# Altium schematic sheet TOP.SchDoc
size A1; SheetNumber: 1; SheetTotal: 16
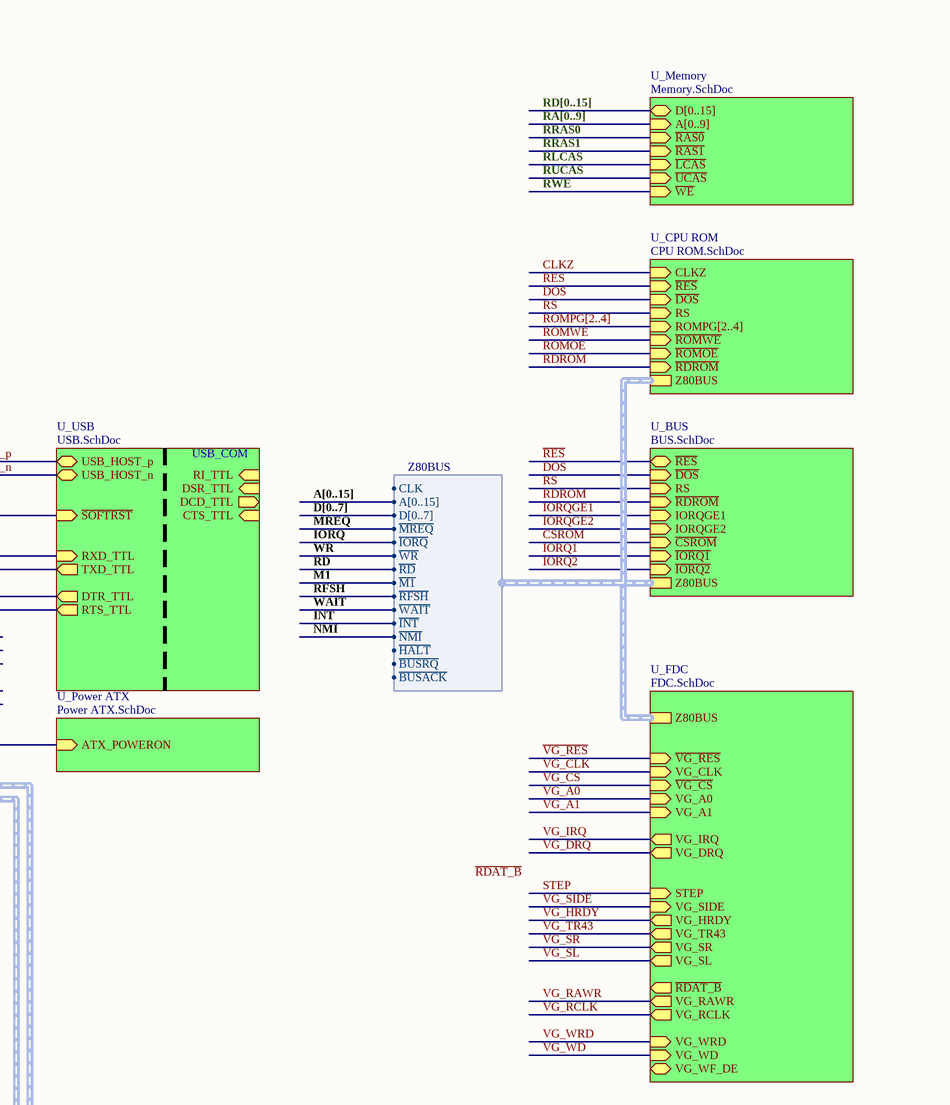
[diagram p0: TOP.SchDoc, top right]
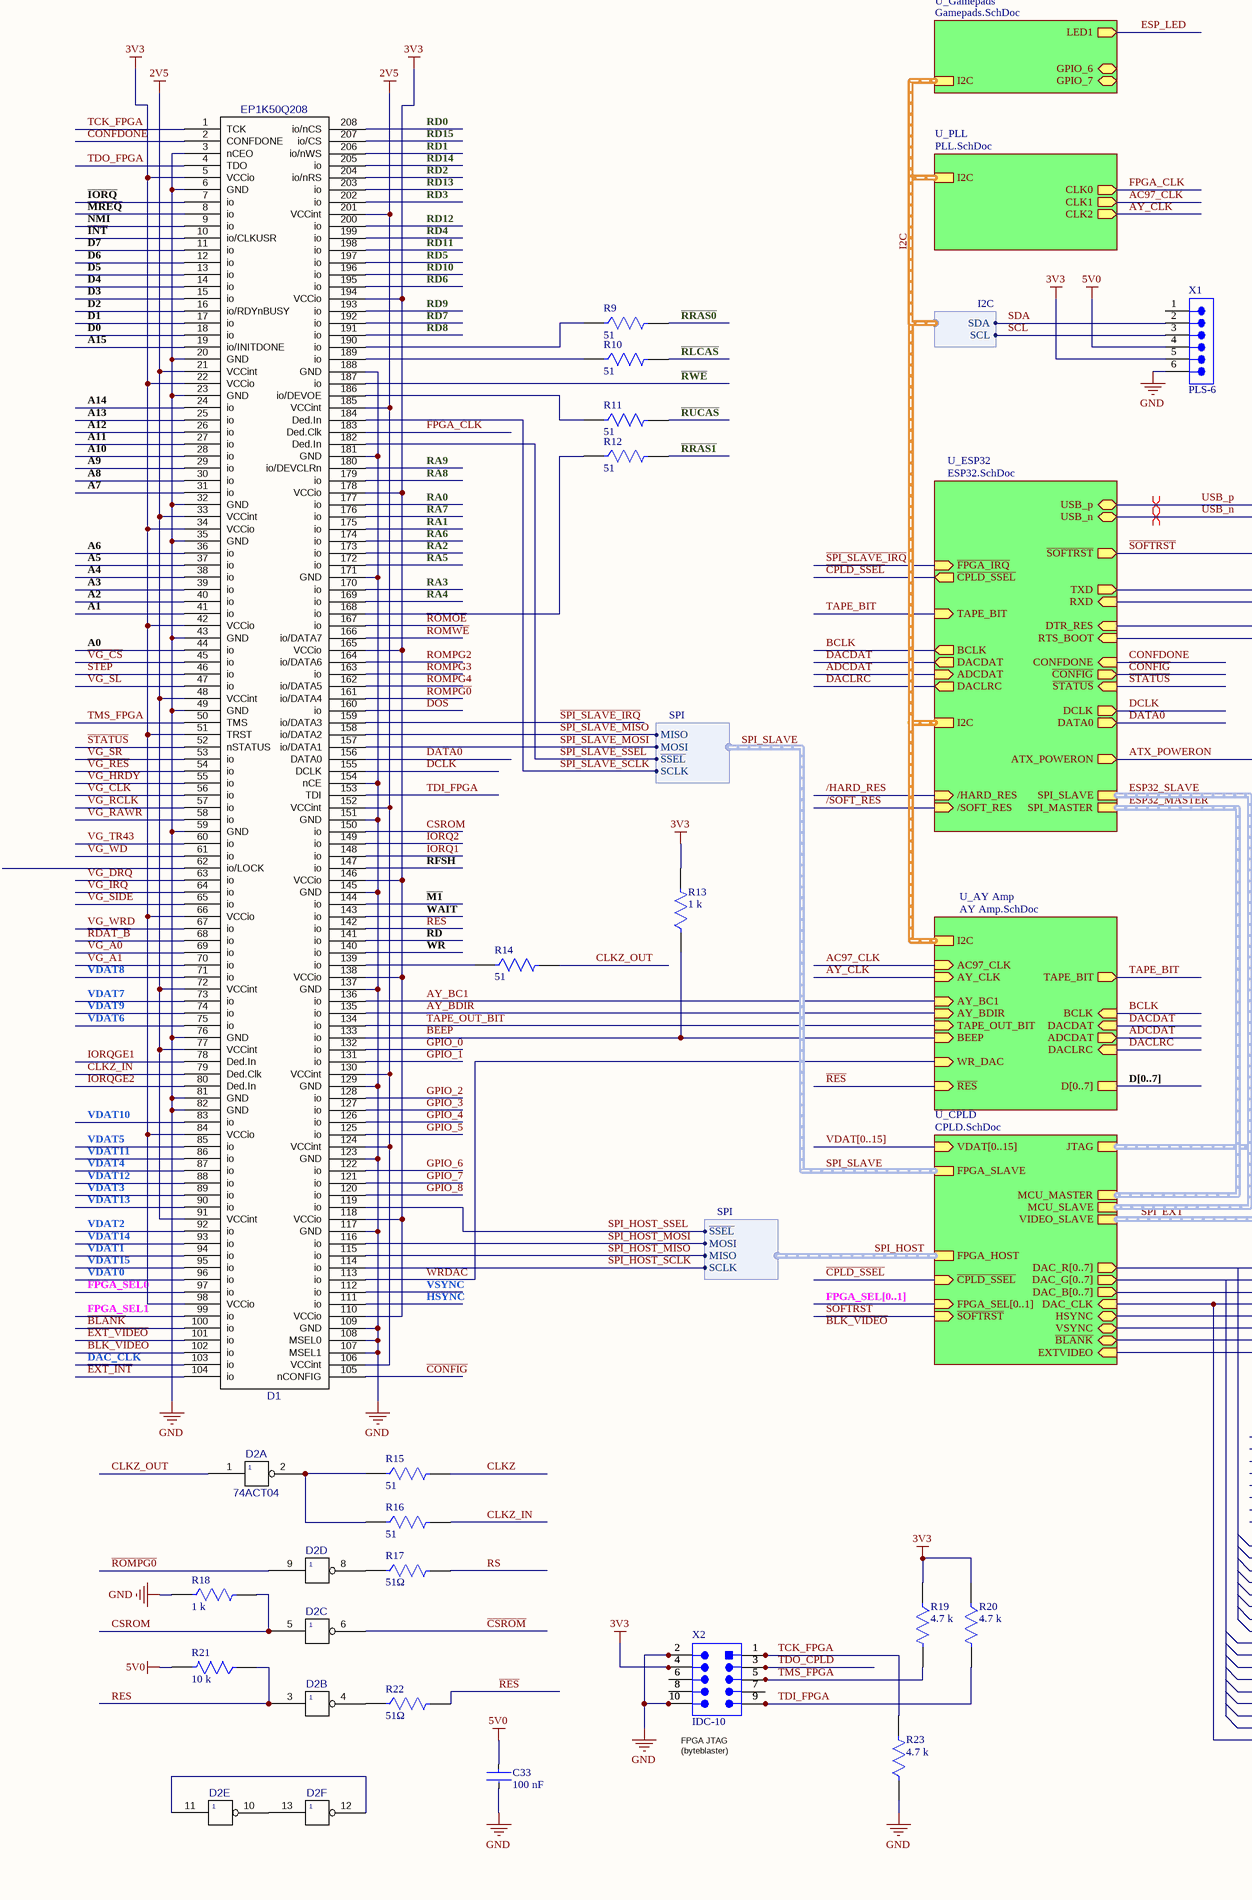
[diagram p1: TOP.SchDoc, bottom left]
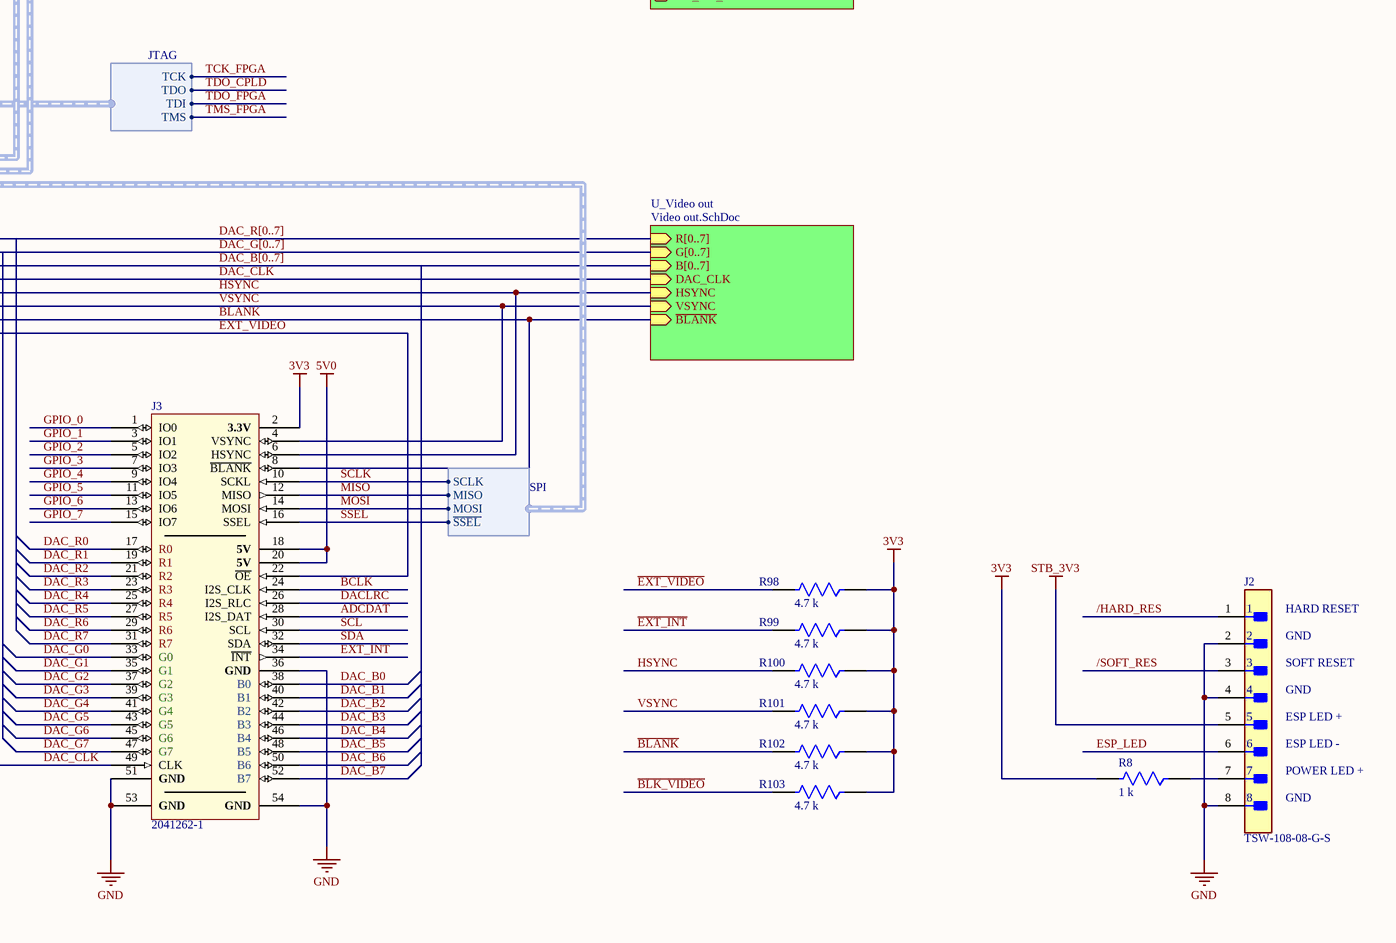
[diagram p2: TOP.SchDoc, bottom right]

## Parts
C33  Capacitance: 100 nF  [CC0805]  (hidden comment: CC0805-1.5pF)
D1  EP1K50Q208  [PQFP208X5]
D2  value 74ACT04  [SO14]  (hidden comment: 04)  (parts A,B,C,D,E,F of 6)
J2  TSW-108-08-G-S  [FP-TSW-108-08-G-S-MFG]
J3  2041262-1  [FP-2041262-1-0]
R8  Resistance: 1 k  [CR0805]  (hidden comment: CR0805-51)
R9  Resistance: 51  [CR0805]  (hidden comment: CR0805-51)
R10  Resistance: 51  [CR0805]  (hidden comment: CR0805-51)
R11  Resistance: 51  [CR0805]  (hidden comment: CR0805-51)
R12  Resistance: 51  [CR0805]  (hidden comment: CR0805-51)
R13  Resistance: 1 k  [CR0805]  (hidden comment: CR0805-51)
R14  Resistance: 51  [CR0805]  (hidden comment: CR0805-51)
R15  Resistance: 51  [CR0805]  (hidden comment: CR0805-51)
R16  Resistance: 51  [CR0805]  (hidden comment: CR0805-51)
R17  value 51Ω  [CR0805]  (hidden comment: CR0805-51)
R18  Resistance: 1 k  [CR0805]  (hidden comment: CR0805-51)
R19  Resistance: 4.7 k  [CR0805]  (hidden comment: CR0805-51)
R20  Resistance: 4.7 k  [CR0805]  (hidden comment: CR0805-51)
R21  Resistance: 10 k  [CR0805]  (hidden comment: CR0805-51)
R22  value 51Ω  [CR0805]  (hidden comment: CR0805-51)
R23  Resistance: 4.7 k  [CR0805]  (hidden comment: CR0805-51)
R98  Resistance: 4.7 k  [CR0805]  (hidden comment: CR0805-51)
R99  Resistance: 4.7 k  [CR0805]  (hidden comment: CR0805-51)
R100  Resistance: 4.7 k  [CR0805]  (hidden comment: CR0805-51)
R101  Resistance: 4.7 k  [CR0805]  (hidden comment: CR0805-51)
R102  Resistance: 4.7 k  [CR0805]  (hidden comment: CR0805-51)
R103  Resistance: 4.7 k  [CR0805]  (hidden comment: CR0805-51)
X1  PLS-6  [SMTC-TSW-106-07-X-S]
X2  IDC-10  [BH-10]

## Sub-sheets
U_AY Amp = AY Amp.SchDoc: AY_BC1 (in), ~{RES} (in), AY_CLK (in), AY_BDIR (in), I2C (harness I2C), DACDAT (in), TAPE_BIT (out), ADCDAT (out), BCLK (in), BEEP (in), DACLRC (in), WR_DAC (in), D[0..7], AC97_CLK (in), TAPE_OUT_BIT (in)
U_BUS = BUS.SchDoc: ~{RES} (bidir), ~{DOS} (in), RS (in), ~{RDROM} (in), IORQGE1 (in), IORQGE2 (in), ~{CSROM} (in), ~{IORQ1} (in), ~{IORQ2} (in), Z80BUS (harness Z80BUS)
U_CPLD = CPLD.SchDoc: VDAT[0..15] (in), VSYNC (bidir), HSYNC (bidir), DAC_CLK (in), FPGA_HOST (harness SPI), FPGA_SLAVE (harness SPI), MCU_MASTER (harness JTAG), MCU_SLAVE (harness SPI), FPGA_SEL[0..1] (in), JTAG (harness JTAG), ~{SOFTRST} (in), ~{CPLD_SSEL} (in), DAC_G[0..7] (out), DAC_B[0..7] (out), DAC_R[0..7] (out), EXTVIDEO (in), ~{BLANK} (bidir), VIDEO_SLAVE (harness SPI)
U_CPU ROM = CPU ROM.SchDoc: CLKZ (in), ~{RES} (in), ~{DOS} (in), RS (in), ROMPG[2..4] (in), ~{ROMWE} (in), ~{ROMOE} (in), ~{RDROM} (in), Z80BUS (harness Z80BUS)
U_ESP32 = ESP32.SchDoc: SPI_SLAVE (harness SPI), TXD (out), RXD (in), DTR_RES (in), RTS_BOOT (in), I2C (harness I2C), TAPE_BIT (in), USB_n (bidir), USB_p (bidir), SPI_MASTER (harness SPI), ~{SOFTRST} (out), ATX_POWERON (out), ~{FPGA_IRQ} (in), DCLK (out), DATA0 (out), ~{STATUS} (in), CONFDONE (in), ~{CONFIG} (out), ~{CPLD_SSEL} (out), DACLRC (out), ADCDAT (in), BCLK (out), DACDAT (out), /HARD_RES (in), /SOFT_RES (in)
U_FDC = FDC.SchDoc: VG_CLK (in), VG_IRQ (out), VG_DRQ (out), ~{VG_CS} (in), VG_SIDE (in), STEP (in), VG_A0 (in), VG_A1 (in), VG_TR43 (out), VG_SR (out), VG_SL (out), VG_WD (in), VG_WRD (in), VG_WF_DE (bidir), VG_RAWR (out), VG_RCLK (out), ~{VG_RES} (in), VG_HRDY (out), Z80BUS (harness Z80BUS), ~{RDAT_B} (out)
U_Gamepads = Gamepads.SchDoc: GPIO_7 (bidir), LED1 (out), GPIO_6 (bidir), I2C (harness I2C)
U_Memory = Memory.SchDoc: D[0..15] (bidir), A[0..9] (in), ~{RAS0} (in), ~{RAS1} (in), ~{LCAS} (in), ~{UCAS} (in), ~{WE} (in)
U_PLL = PLL.SchDoc: CLK0 (out), CLK1 (out), CLK2 (out), I2C (harness I2C)
U_Power ATX = Power ATX.SchDoc: ATX_POWERON (in)
U_USB = USB.SchDoc: RXD_TTL (in), USB_HOST_p (bidir), TXD_TTL (out), RTS_TTL (out), CTS_TTL (in), DCD_TTL (out), DSR_TTL (in), USB_HOST_n (bidir), RI_TTL (in), DTR_TTL (out), ~{SOFTRST} (in)
U_Video out = Video out.SchDoc: R[0..7] (in), G[0..7] (in), B[0..7] (in), DAC_CLK (in), HSYNC (in), VSYNC (in), ~{BLANK} (in)

## Harnesses
SPI: ~{SSEL}, SCLK, MOSI, MISO
JTAG: TCK, TDO, TDI, TMS
I2C: SDA, SCL
Z80BUS: A[0..15], D[0..7], ~{MREQ}, ~{IORQ}, ~{WR}, ~{RD}, ~{M1}, ~{RFSH}, ~{WAIT}, ~{INT}, ~{NMI}, ~{HALT}, ~{BUSRQ}, ~{BUSACK}, CLK

## Nets
2V5: D1.21(VCCint) D1.33(VCCint) D1.48(VCCint) D1.72(VCCint) D1.77(VCCint) D1.91(VCCint) D1.106(VCCint) D1.124(VCCint) D1.130(VCCint) D1.152(VCCint) D1.185(VCCint) D1.201(VCCint)
3V3: D1.5(VCCio) D1.22(VCCio) D1.34(VCCio) D1.42(VCCio) D1.51(TRST) D1.66(VCCio) D1.84(VCCio) D1.98(VCCio) D1.110(VCCio) D1.118(VCCio) D1.138(VCCio) D1.146(VCCio) D1.165(VCCio) D1.178(VCCio) D1.194(VCCio) J3.2(3.3V) R8.2 R13.2 R19.1 R20.1 R98.1 R99.1 R100.1 R101.1 R102.1 R103.1 X1.5 X2.4
5V0: C33.1 J3.18(5V) J3.20(5V) R21.2 X1.4
GND: C33.2 D1.3(nCEO) D1.6(GND) D1.20(GND) D1.23(GND) D1.32(GND) D1.35(GND) D1.43(GND) D1.49(GND) D1.59(GND) D1.76(GND) D1.81(GND) D1.82(GND) D1.107(MSEL1) D1.108(MSEL0) D1.109(GND) D1.117(GND) D1.123(GND) D1.129(GND) D1.137(GND) D1.145(GND) D1.151(GND) D1.154(nCE) D1.171(GND) D1.181(GND) D1.188(GND) D2.7(GND) J2.2 J2.4 J2.8 J3.36(GND) J3.51(GND) J3.53(GND) J3.54(GND) R18.1 R23.1 X1.6 X2.2 X2.10
STB_3V3: J2.5
VCC5: D2.14(+5v)
/HARD_RES: J2.1 ; sheet U_ESP32//HARD_RES
/SOFT_RES: J2.3 ; sheet U_ESP32//SOFT_RES
A0: D1.44(io)
A1: D1.41(io)
A2: D1.40(io)
A3: D1.39(io)
A4: D1.38(io)
A5: D1.37(io)
A6: D1.36(io)
A7: D1.31(io)
A8: D1.30(io)
A9: D1.29(io)
A10: D1.28(io)
A11: D1.27(io)
A12: D1.26(io)
A13: D1.25(io)
A14: D1.24(io)
A15: D1.19(io/INITDONE)
AC97_CLK: sheet U_AY Amp/AC97_CLK, sheet U_PLL/CLK1
ADCDAT: J3.28(I2S_DAT) ; sheet U_ESP32/ADCDAT, sheet U_AY Amp/ADCDAT
ATX_POWERON: sheet U_Power ATX/ATX_POWERON, sheet U_ESP32/ATX_POWERON
AY_BC1: D1.136(io) ; sheet U_AY Amp/AY_BC1
AY_BDIR: D1.135(io) ; sheet U_AY Amp/AY_BDIR
AY_CLK: sheet U_AY Amp/AY_CLK, sheet U_PLL/CLK2
~{BLANK}: D1.100(io) J3.8(~{BLANK}) R102.2 ; sheet U_CPLD/~{BLANK}, sheet U_Video out/~{BLANK}
~{BLK_VIDEO}: D1.102(io) R103.2
BCLK: J3.24(I2S_CLK) ; sheet U_ESP32/BCLK, sheet U_AY Amp/BCLK
BEEP: D1.133(io) R13.1 ; sheet U_AY Amp/BEEP
~{CONFIG}: D1.105(nCONFIG) ; sheet U_ESP32/~{CONFIG}
~{CPLD_SSEL}: sheet U_CPLD/~{CPLD_SSEL}, sheet U_ESP32/~{CPLD_SSEL}
~{CSROM}: D2.6 ; sheet U_BUS/~{CSROM}
CLKZ: R15.2 ; sheet U_CPU ROM/CLKZ
CLKZ_IN: D1.79(Ded.Clk) R16.2
CLKZ_OUT: D2.1 R14.2
CONFDONE: D1.2(CONFDONE) ; sheet U_ESP32/CONFDONE
CSROM: D1.150(io) D2.5 R18.2
D0: D1.18(io)
D1: D1.17(io)
D2: D1.16(io/RDYnBUSY)
D3: D1.15(io)
D4: D1.14(io)
D5: D1.13(io)
D6: D1.12(io)
D7: D1.11(io)
~{DOS}: D1.160(io) ; sheet U_CPU ROM/~{DOS}, sheet U_BUS/~{DOS}
DAC_B0: J3.38(B0)
DAC_B1: J3.40(B1)
DAC_B2: J3.42(B2)
DAC_B3: J3.44(B3)
DAC_B4: J3.46(B4)
DAC_B5: J3.48(B5)
DAC_B6: J3.50(B6)
DAC_B7: J3.52(B7)
DAC_CLK: D1.103(io) J3.49(CLK) ; sheet U_CPLD/DAC_CLK, sheet U_Video out/DAC_CLK
DAC_G0: J3.33(G0)
DAC_G1: J3.35(G1)
DAC_G2: J3.37(G2)
DAC_G3: J3.39(G3)
DAC_G4: J3.41(G4)
DAC_G5: J3.43(G5)
DAC_G6: J3.45(G6)
DAC_G7: J3.47(G7)
DAC_R0: J3.17(R0)
DAC_R1: J3.19(R1)
DAC_R2: J3.21(R2)
DAC_R3: J3.23(R3)
DAC_R4: J3.25(R4)
DAC_R5: J3.27(R5)
DAC_R6: J3.29(R6)
DAC_R7: J3.31(R7)
DACDAT: sheet U_ESP32/DACDAT, sheet U_AY Amp/DACDAT
DACLRC: J3.26(I2S_RLC) ; sheet U_ESP32/DACLRC, sheet U_AY Amp/DACLRC
DATA0: D1.156(DATA0) ; sheet U_ESP32/DATA0
DCLK: D1.155(DCLK) ; sheet U_ESP32/DCLK
~{EXT_INT}: D1.104(io) J3.34(~{INT}) R99.2
~{EXT_VIDEO}: D1.101(io) J3.22(~{OE}) R98.2 ; sheet U_CPLD/EXTVIDEO
ESP_LED: J2.6 ; sheet U_Gamepads/LED1
FPGA_CLK: D1.183(Ded.Clk) ; sheet U_PLL/CLK0
FPGA_SEL0: D1.97(io)
FPGA_SEL1: D1.99(io)
GPIO_0: D1.132(io) J3.1(IO0)
GPIO_1: D1.131(io) J3.3(IO1)
GPIO_2: D1.128(io) J3.5(IO2)
GPIO_3: D1.127(io) J3.7(IO3)
GPIO_4: D1.126(io) J3.9(IO4)
GPIO_5: D1.125(io) J3.11(IO5)
GPIO_6: D1.122(io) J3.13(IO6)
GPIO_7: D1.121(io) J3.15(IO7)
GPIO_8: D1.120(io)
HSYNC: D1.111(io) J3.6(HSYNC) R100.2 ; sheet U_CPLD/HSYNC, sheet U_Video out/HSYNC
~{INT}: D1.10(io/CLKUSR) ; sheet U_CPU ROM/Z80BUS.~{INT}
~{IORQ}: D1.7(io) ; sheet U_CPU ROM/Z80BUS.~{IORQ}
~{IORQ1}: D1.148(io) ; sheet U_BUS/~{IORQ1}
~{IORQ2}: D1.149(io) ; sheet U_BUS/~{IORQ2}
IORQGE1: D1.78(Ded.In) ; sheet U_BUS/IORQGE1
IORQGE2: D1.80(Ded.In) ; sheet U_BUS/IORQGE2
~{M1}: D1.144(io) ; sheet U_CPU ROM/Z80BUS.~{M1}
~{MREQ}: D1.8(io) ; sheet U_CPU ROM/Z80BUS.~{MREQ}
MISO: J3.12(MISO) ; sheet U_CPLD/VIDEO_SLAVE.MISO
MOSI: J3.14(MOSI) ; sheet U_CPLD/VIDEO_SLAVE.MOSI
~{NMI}: D1.9(io) ; sheet U_CPU ROM/Z80BUS.~{NMI}
~{RD}: D1.141(io) ; sheet U_CPU ROM/Z80BUS.~{RD}
~{RDAT_B}: D1.68(io)
~{RDROM}: sheet U_CPU ROM/~{RDROM}, sheet U_BUS/~{RDROM}
~{RES}: R22.2 ; sheet U_CPU ROM/~{RES}, sheet U_BUS/~{RES}, sheet U_AY Amp/~{RES}
~{RFSH}: D1.147(io) ; sheet U_CPU ROM/Z80BUS.~{RFSH}
~{RLCAS}: R10.2 ; sheet U_Memory/~{LCAS}
~{ROMOE}: D1.167(io) ; sheet U_CPU ROM/~{ROMOE}
~{ROMPG0}: D1.161(io/DATA4) D2.9
~{ROMWE}: D1.166(io/DATA7) ; sheet U_CPU ROM/~{ROMWE}
~{RRAS0}: R9.2 ; sheet U_Memory/~{RAS0}
~{RRAS1}: R12.2 ; sheet U_Memory/~{RAS1}
~{RUCAS}: R11.2 ; sheet U_Memory/~{UCAS}
~{RWE}: D1.187(io) ; sheet U_Memory/~{WE}
RA0: D1.177(io)
RA1: D1.175(io)
RA2: D1.173(io)
RA3: D1.170(io)
RA4: D1.169(io)
RA5: D1.172(io)
RA6: D1.174(io)
RA7: D1.176(io)
RA8: D1.179(io)
RA9: D1.180(io/DEVCLRn)
RD0: D1.208(io/nCS)
RD1: D1.206(io/nWS)
RD2: D1.204(io/nRS)
RD3: D1.202(io)
RD4: D1.199(io)
RD5: D1.197(io)
RD6: D1.195(io)
RD7: D1.192(io)
RD8: D1.191(io)
RD9: D1.193(io)
RD10: D1.196(io)
RD11: D1.198(io)
RD12: D1.200(io)
RD13: D1.203(io)
RD14: D1.205(io)
RD15: D1.207(io/CS)
RES: D1.142(io) D2.3 R21.1
ROMPG2: D1.164(io/DATA6)
ROMPG3: D1.163(io)
ROMPG4: D1.162(io/DATA5)
RS: R17.2 ; sheet U_CPU ROM/RS, sheet U_BUS/RS
~{SOFTRST}: sheet U_CPLD/~{SOFTRST}, sheet U_USB/~{SOFTRST}, sheet U_ESP32/~{SOFTRST}
~{SPI_SLAVE_IRQ}: D1.159(io/DATA3) ; sheet U_ESP32/~{FPGA_IRQ}
~{SPI_SLAVE_SSEL}: D1.182(Ded.In) ; sheet U_CPLD/FPGA_SLAVE.~{SSEL}
~{STATUS}: D1.52(nSTATUS) ; sheet U_ESP32/~{STATUS}
SCL: J3.30(SCL) X1.3 ; sheet U_ESP32/I2C.SCL  [project net I2C.SCL]
SCLK: J3.10(SCKL) ; sheet U_CPLD/VIDEO_SLAVE.SCLK
SDA: J3.32(SDA) X1.2 ; sheet U_ESP32/I2C.SDA  [project net I2C.SDA]
SPI_HOST_MISO: D1.115(io) ; sheet U_CPLD/FPGA_HOST.MISO  [project net SPI_HOST.MISO]
SPI_HOST_MOSI: D1.116(io) ; sheet U_CPLD/FPGA_HOST.MOSI  [project net SPI_HOST.MOSI]
SPI_HOST_SCLK: D1.114(io) ; sheet U_CPLD/FPGA_HOST.SCLK  [project net SPI_HOST.SCLK]
SPI_HOST_SSEL: D1.119(io) ; sheet U_CPLD/FPGA_HOST.~{SSEL}  [project net SPI_HOST.~{SSEL}]
SPI_SLAVE_MISO: D1.158(io/DATA2) ; sheet U_CPLD/FPGA_SLAVE.MISO  [project net SPI_SLAVE.MISO]
SPI_SLAVE_MOSI: D1.157(io/DATA1) ; sheet U_CPLD/FPGA_SLAVE.MOSI  [project net SPI_SLAVE.MOSI]
SPI_SLAVE_SCLK: D1.184(Ded.In) ; sheet U_CPLD/FPGA_SLAVE.SCLK  [project net SPI_SLAVE.SCLK]
SSEL: J3.16(SSEL) ; sheet U_CPLD/VIDEO_SLAVE.~{SSEL}  [project net SPI_EXT.~{SSEL}]
STEP: D1.46(io) ; sheet U_FDC/STEP
TAPE_BIT: sheet U_ESP32/TAPE_BIT, sheet U_AY Amp/TAPE_BIT
TAPE_OUT_BIT: D1.134(io) ; sheet U_AY Amp/TAPE_OUT_BIT
TCK_FPGA: D1.1(TCK) R23.2 X2.1 ; sheet U_CPLD/JTAG.TCK
TDI_FPGA: D1.153(TDI) R20.2 X2.9
TDO_CPLD: X2.3 ; sheet U_CPLD/JTAG.TDO
TDO_FPGA: D1.4(TDO) ; sheet U_CPLD/JTAG.TDI
TMS_FPGA: D1.50(TMS) R19.2 X2.5 ; sheet U_CPLD/JTAG.TMS
USB_n: sheet U_USB/USB_HOST_n, sheet U_ESP32/USB_n
USB_p: sheet U_USB/USB_HOST_p, sheet U_ESP32/USB_p
~{VG_CS}: D1.45(io) ; sheet U_FDC/~{VG_CS}
~{VG_RES}: D1.54(io) ; sheet U_FDC/~{VG_RES}
VDAT0: D1.96(io)
VDAT1: D1.94(io)
VDAT2: D1.92(io)
VDAT3: D1.89(io)
VDAT4: D1.87(io)
VDAT5: D1.85(io)
VDAT6: D1.75(io)
VDAT7: D1.73(io)
VDAT8: D1.71(io)
VDAT9: D1.74(io)
VDAT10: D1.83(io)
VDAT11: D1.86(io)
VDAT12: D1.88(io)
VDAT13: D1.90(io)
VDAT14: D1.93(io)
VDAT15: D1.95(io)
VG_A0: D1.69(io) ; sheet U_FDC/VG_A0
VG_A1: D1.70(io) ; sheet U_FDC/VG_A1
VG_CLK: D1.56(io) ; sheet U_FDC/VG_CLK
VG_DRQ: D1.63(io) ; sheet U_FDC/VG_DRQ
VG_HRDY: D1.55(io) ; sheet U_FDC/VG_HRDY
VG_IRQ: D1.64(io) ; sheet U_FDC/VG_IRQ
VG_RAWR: D1.58(io) ; sheet U_FDC/VG_RAWR
VG_RCLK: D1.57(io) ; sheet U_FDC/VG_RCLK
VG_SIDE: D1.65(io) ; sheet U_FDC/VG_SIDE
VG_SL: D1.47(io) ; sheet U_FDC/VG_SL
VG_SR: D1.53(io) ; sheet U_FDC/VG_SR
VG_TR43: D1.60(io) ; sheet U_FDC/VG_TR43
VG_WD: D1.61(io) ; sheet U_FDC/VG_WD
VG_WRD: D1.67(io) ; sheet U_FDC/VG_WRD
VSYNC: D1.112(io) J3.4(VSYNC) R101.2 ; sheet U_CPLD/VSYNC, sheet U_Video out/VSYNC
~{WAIT}: D1.143(io) ; sheet U_CPU ROM/Z80BUS.~{WAIT}
~{WR}: D1.140(io) ; sheet U_CPU ROM/Z80BUS.~{WR}
WRDAC: D1.113(io) ; sheet U_AY Amp/WR_DAC
NetD1_139: D1.139(io) R14.1
NetD1_168: D1.168(io) R12.1
NetD1_186: D1.186(io/DEVOE) R11.1
NetD1_189: D1.189(io) R10.1
NetD1_190: D1.190(io) R9.1
NetD2_2: D2.2 R15.1 R16.1
NetD2_4: D2.4 R22.1
NetD2_8: D2.8 R17.1
NetD2_10: D2.10 D2.13
NetD2_11: D2.11 D2.12
NetJ2_7: J2.7 R8.1
(unnamed): sheet U_USB/RXD_TTL, sheet U_ESP32/TXD
(unnamed): sheet U_USB/TXD_TTL, sheet U_ESP32/RXD
(unnamed): sheet U_USB/RTS_TTL, sheet U_ESP32/RTS_BOOT
(unnamed): sheet U_USB/DTR_TTL, sheet U_ESP32/DTR_RES

Not connected (* = marked no-connect by the designer): D1 62(io/LOCK); X1 1; X2 6 7 8

## Buses and harness runs
bus A[0..15]
bus D[0..7]
bus D[0..7] = sheet U_AY Amp/D[0..7]
bus DAC_B[0..7] = sheet U_CPLD/DAC_B[0..7] = sheet U_Video out/B[0..7]
bus DAC_G[0..7] = sheet U_CPLD/DAC_G[0..7] = sheet U_Video out/G[0..7]
bus DAC_R[0..7] = sheet U_CPLD/DAC_R[0..7] = sheet U_Video out/R[0..7]
bus FPGA_SEL[0..1] = sheet U_CPLD/FPGA_SEL[0..1]
bus RA[0..9] = sheet U_Memory/A[0..9]
bus RD[0..15] = sheet U_Memory/D[0..15]
bus ROMPG[2..4] = sheet U_CPU ROM/ROMPG[2..4]
bus VDAT[0..15] = sheet U_CPLD/VDAT[0..15]
harness ESP32_MASTER = sheet U_CPLD/MCU_MASTER = sheet U_ESP32/SPI_MASTER
harness ESP32_SLAVE = sheet U_CPLD/MCU_SLAVE = sheet U_ESP32/SPI_SLAVE
harness I2C = sheet U_AY Amp/I2C = sheet U_ESP32/I2C = sheet U_Gamepads/I2C = sheet U_PLL/I2C
harness sheet U_BUS/Z80BUS = sheet U_CPU ROM/Z80BUS = sheet U_FDC/Z80BUS
harness SPI_EXT = sheet U_CPLD/VIDEO_SLAVE
harness SPI_HOST = sheet U_CPLD/FPGA_HOST
harness SPI_SLAVE = sheet U_CPLD/FPGA_SLAVE

## Layout directives
differential pair: USB_n, USB_p

## Notes on the sheet
- USB_COM
- (near J2) HARD RESET
- (near J2) SOFT RESET
- (near J2) GND
- (near J2) ESP LED +
- (near J2) ESP LED -
- (near X2) FPGA JTAG
  (byteblaster)
- (near J2) POWER LED +
- Labels drawn without touching a wire or pin: ~{BLK_VIDEO}, ~{RDAT_B}

## Library data of the parts
C33 = CC0805: CL21 Series 0805 1.5pF 50V ±0.25pF Tolerance C0G Multilayer Ceramic Chip Capacitor; Manufacturer Part Number: CL21C1R5CBANNNC; Manufacturer: Samsung; value: 1.5pF; Category: Cap; Case/Package: 0805
J2 = CMP-02766-000001-1: CONN HEADER VERT 8POS 2.54MM; Manufacturer: Samtec; Number Of Contacts: 8; Conn Orientation: Straight; Conn Gender: Male; Device Class L1: Connectors; ComponentLink2Description: Datasheet; Digikey Description: CONN HEADER VERT 8POS 2.54MM; ComponentLink2URL: http://suddendocs.samtec.com/catalog_english/tsw_th.pdf; Temperature: -55°C to +125°C; RoHS: TRUE; Mouser Description: TSW - Samtec 2.54mm Pin Header 13.46mm Overall Pin Length 5.08mm Tail; Automotive: No; Temperature Range High: +125°C; Package: TSW-108-08-G-S; Device Class L3: unset; Manufacturer Part Number: TSW-108-08-G-S; Pitch: 2.54mm; Number Of Rows: 1; Lead Free: Yes; Height: 8.71mm; Contact Material: Gold,Nickel; Footprint Url: http://suddendocs.samtec.com/prints/tsw-xxx-xx-x-x-xx-xxx-footprint.pdf; Temperature Range Low: -55°C; Octopart: https://octopart.com/tsw-108-08-g-s-samtec-272653; Category: Conn; Device Class L2: Headers and Wire Housings
J3 = CMP-03365-000006-1: CONN PCI EXP MINI FEMALE 52POS; Manufacturer: TE Connectivity AMP; Number of Positions: 52; High Temperature Housing: Yes; PCB Mounting Orientation: Horizontal; Row Spacing: 0.031inch; Connector Type: Receptacle; Pitch: 0.8mm; PCB Mount Retention: Without; Stackable: No; Stack Height: 0.268inch; Number of Contacts: 52; Mount: Surface Mount; ELV: Compliant; Orientation: Right Angle; Flammability Rating: UL94 V-0; Number of Pins: 52; Housing Color: Black; Packaging: Tape and Reel; Contact Plating: Gold; Lead Free: Lead Free; Termination: Solder; Package Quantity: 450; Contact Material: Copper Alloy; Max Operating Temperature: 85°C; Min Operating Temperature: -55°C; Number of Rows: 2; RoHS Compliant: Yes; Housing Material: Thermoplastic; Manufacturer Part Number: 2041262-1
R8-R16 R18-R21 R23 R98-R103 = CR0805: 51Ω ±0.5% 0.1W 1/10W Chip Resistor 0805 (2012 Metric) Thin Film; Manufacturer: Susumu; Manufacturer Part Number: RR1220Q-510-D; Case/Package: 0805; Number of Terminations: 2; value: 51Ω; Category: Res; Termination: SMD/SMT; Number of Pins: 2
R17 R22 = CR0805: 51Ω ±0.5% 0.1W 1/10W Chip Resistor 0805 (2012 Metric) Thin Film; Manufacturer: Susumu; Manufacturer Part Number: RR1220Q-510-D; Resistance: 680; Category: Res; Case/Package: 0805; Number of Terminations: 2; Termination: SMD/SMT; Number of Pins: 2
X1 = CMP-1024-00383-1: 0.025" SQ Post Header, Through-hole, Vertical, -55 to 125 degC, 2.54 mm Pitch, 6-Pin, Male, RoHS; Manufacturer: Samtec; PartNumber: TSW-106-07-G-S; Pitch: 2.54 mm; value: 6 pin header 2.54mm; PackageDescription: .025[0.64] SQ. Post Terminal Strip Assembly; Manufacturer Part Number: TSW-106-07-G-S; Case/Package: PLS-6; Category: Connector
X2 = IDC-10: Male Header, Pitch 2.54 mm, 2 x 5 Postion, Height 9.91 mm, Tail Length 2.84 mm, -55 to 105 degC, RoHS, Bulk; PartNumber: N2510; Manufacturer: 3M; Manufacturer Part Number: N2510-6002RB; Pitch: 2.54mm; value: 10-Pin Shrouded Header, 2.54mm; Case/Package: IDC-10; Category: Connector
D1 = EP1K50Q208: Value: EP1K50Q208; Case/Package: PQFP-208; Category: IC
D2 = 04: Case/Package: SOIC-14; Category: IC